# EAGLE design harkled (EAGLE 7.2.0)
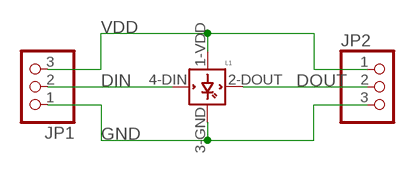
[diagram p0: schematic, sheet 1]

## Parts
JP1  PINHD-1X3  [1X03]
JP2  PINHD-1X3  [1X03]
L1  WS2812B  [WS2812B]

## Nets
DIN: JP1.2 L1.4-DIN(DIN)
DOUT: JP2.2 L1.2-DOUT(DOUT)
GND: JP1.1 JP2.3 L1.3-GND(GND)
VDD: JP1.3 JP2.1 L1.1-VDD(VDD)

## Library data of the parts
JP1 JP2 = pinhead:PINHD-1X3: PIN HEADER
L1 = adafruit:WS2812B

## Net classes
0 default: clearance 0.205 mm

## Board
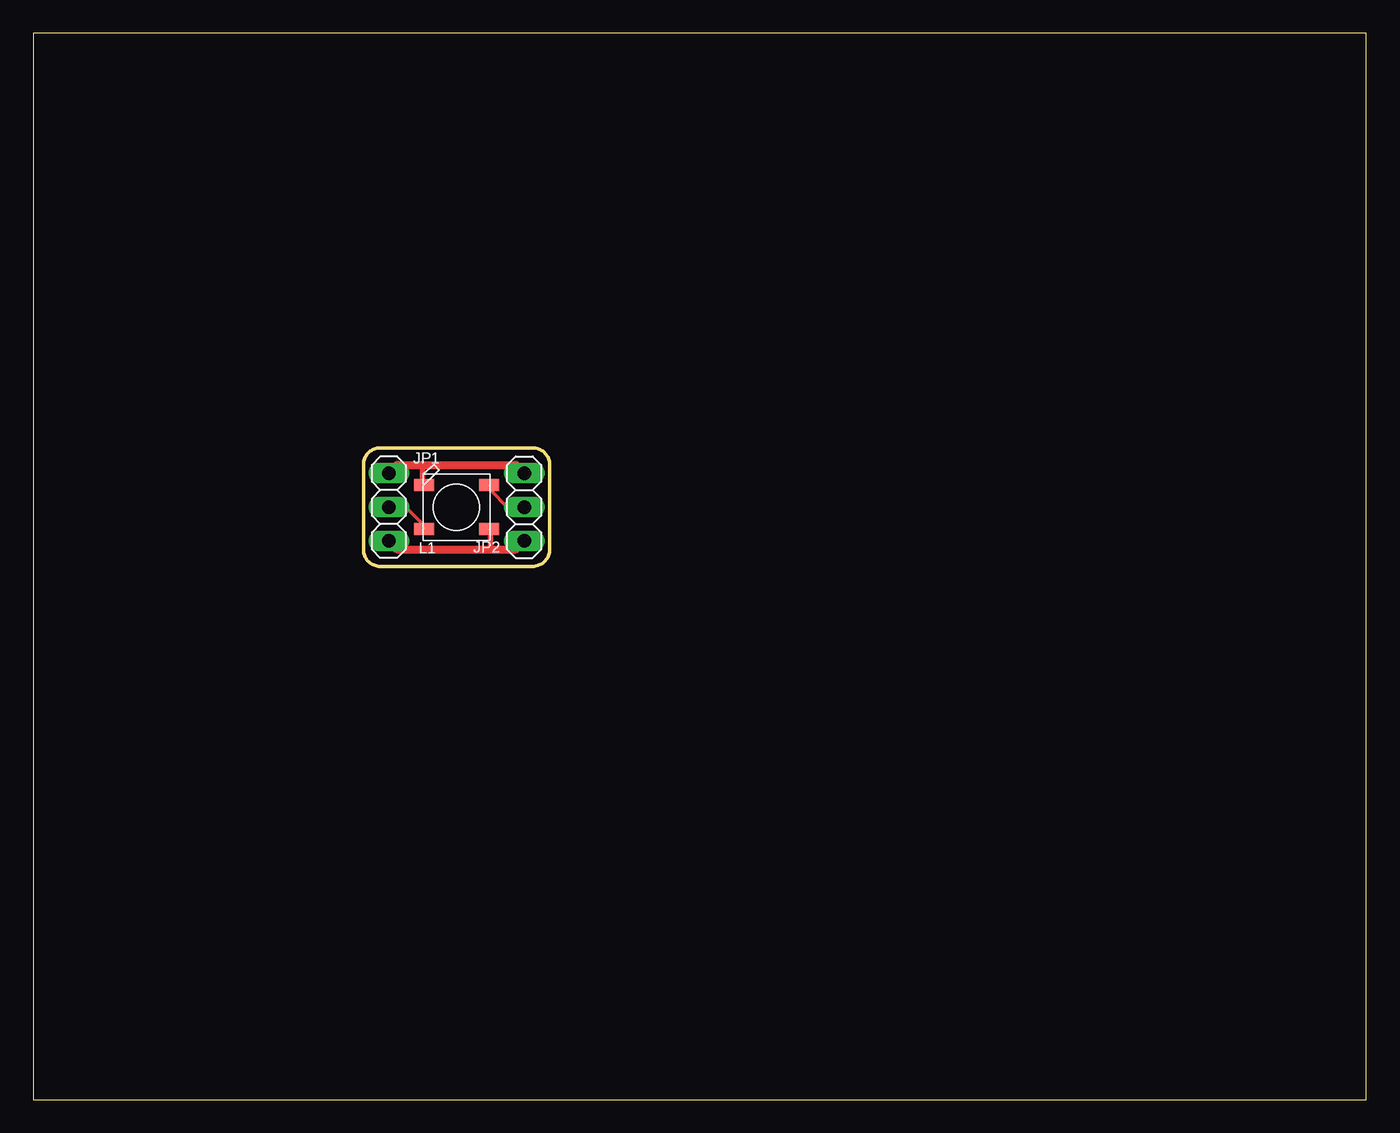
[diagram p1: board, top side]

Size 100 x 80 mm. Coordinates in mm from the lower left corner, seen from the top.
Outline: 0,0 100,0 100,80 0,80 0,0
Outline: 37.47,40.01 26.04,40.01 arc-90 24.77,41.27 24.77,47.62 arc-90 26.04,48.9 37.47,48.9 arc-90 38.73,47.62 38.73,41.27 arc-90 37.47,40.01
Copper layers (1*16): Top 0.035mm / dielectric 1.5mm / Bottom 0.035mm
Design rules "ITead_rule": minimum track width 6mil, minimum drill 12mil, track to track 6mil, track to pad 6mil, pad to pad 6mil, via to via 6mil, smd to smd 0mil, copper to edge 10mil, drill to drill 10mil, minimum pad ring 10mil, minimum via ring 6mil, stop-mask expansion 2mil, vias tented up to drill 100mil, thermal gap 10mil

### Footprints (pad centres in the part's own frame; a part is rotated, then mirrored left to right if it is on the bottom)
1X03 = drill 1.016 long: 1 -2.54,0; 2 0,0; 3 2.54,0
WS2812B = smd 1.5 x 0.9: 1-VDD 2.45,-1.65; 2-DOUT 2.45,1.65; 3-GND -2.45,1.65; 4-DIN -2.45,-1.65

### Placement (x,y rotation side)
JP1  26.67,44.45 270 top
JP2  36.83,44.45 90 top
L1  31.75,44.45 0 top

### Tracks (layer width: path | path; a pad name or v marks a point on that pad's centre or on a via)
DIN  (1 unrouted)
  Top 0.254: JP1.2 27.94,44.45 29.21,43.18
DOUT  (1 unrouted)
  Top 0.254: 34.29,45.72 35.56,44.45 JP2.2
GND  (1 unrouted)
  Top 0.406: 29.21,46.35 29.21,47.62
  Top 0.61: JP1.1 27.3,47.62 29.21,47.62 36.2,47.62 JP2.3
VDD  (1 unrouted)
  Top 0.406: 34.29,41.27 34.29,42.55
  Top 0.61: JP1.3 27.3,41.27 34.29,41.27 36.2,41.27 JP2.1

### Text on the board
_tNames: JP1 | JP2 | L1